# EAGLE design creekboard (EAGLE 7.2.0)
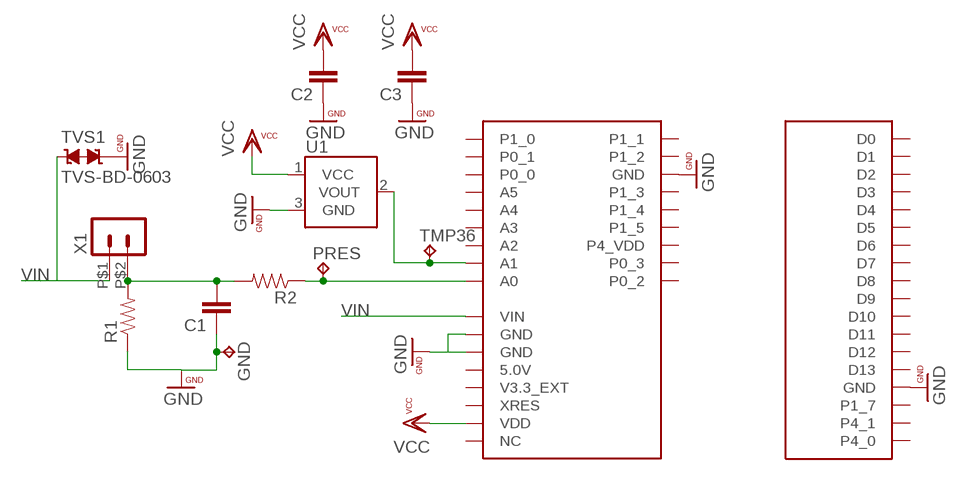
[diagram p0: schematic, sheet 1]

## Parts
C1  CAP0603-CAP  [0603-CAP]
C2  CAP0603-CAP  [0603-CAP]
C3  CAP0603-CAP  [0603-CAP]
GND  TP-040  [TP-040]
PRES  TP-040  [TP-040]
R1  RESISTOR0805-RES  [0805]
R2  RESISTOR0603-RES  [0603-RES]
TMP36  TP-040  [TP-040]
TVS1  TVS-BD-0603  [TVS0603]
U1  TMP36GT9  [TO-92]
U2  PIONEERNO_SILK  [PIONEER]
X1  HEADER_POS2_43650-0200  [43650-0200]

## Nets
GND [power]: C1.1 C2.1 C3.1 GND.1 R1.1 TVS1.2 U1.3(GND) U2.GND@2(GND) U2.GND@3(GND) U2.GND@3R(GND) U2.GND@7(GND)
N$1: C1.2 R1.2 R2.2 X1.P$2
N$2: PRES.1 R2.1 U2.A0
N$3: TMP36.1 U1.2(VOUT) U2.A1
VCC [power]: C2.2 C3.2 U1.1(VCC) U2.P4_VDD1(VDD)
VIN [power]: TVS1.1 U2.VIN X1.P$1
Unconnected: U2.3.3V(V3.3_EXT) U2.5V(5.0V) U2.A2 U2.A3 U2.A4 U2.A5 U2.AREF(P1_7) U2.D0 U2.D1 U2.D2 U2.D3 U2.D4 U2.D5 U2.D6 U2.D7 U2.D8 U2.D9 U2.D10 U2.D11 U2.D12 U2.D13 U2.NC@8(NC) U2.P0_0 U2.P0_1 U2.P0_2 U2.P0_3 U2.P1_0 U2.P1_1 U2.P1_2 U2.P1_3 U2.P1_4 U2.P1_5 U2.P4_VDD U2.SCL(P4_0) U2.SDA(P4_1) U2.XRES

## Library data of the parts
C1-C3 = SparkFun-Capacitors:CAP: Capacitor Standard 0603 ceramic capacitor, and 0.1" leaded capacitor.
GND PRES TMP36 = keystone:TP: TEST POINT PCB Vertical Mount
R1 = SparkFun-Passives:RESISTOR: Resistor
R2 = SparkFun:RESISTOR: Resistor
TVS1 = supressor:TVS-BD-: TVS BI-DIRECTIONAL
U1 = SparkFun-Sensors:TMP36: Precision degC temp sensor, analog out
U2 = arh:PIONEER: Arduino shield footprint
X1 = con-molex-micro-fit-3_0:HEADER_POS2_?: Molex - Micro-Fit 3.0 Series connector, 3.00mm (0.118") pitch header, 2 positions.

## Net classes
1 power: width 0.762 mm, clearance 0.254 mm

## Board
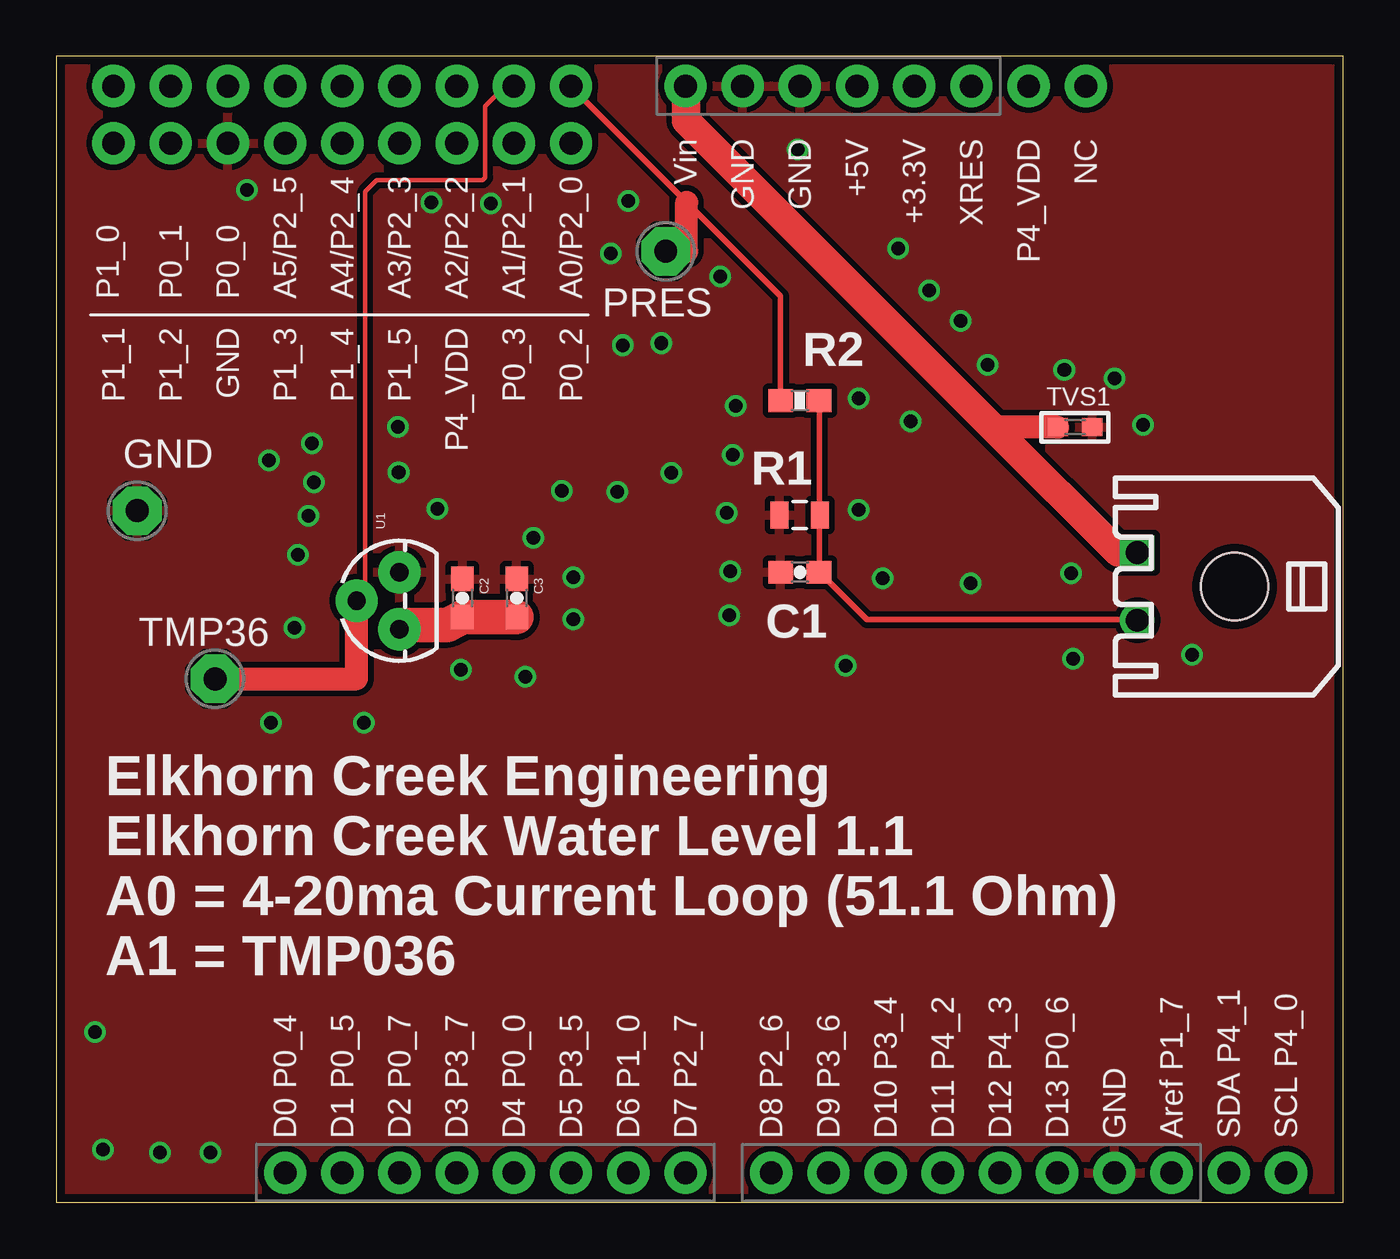
[diagram p1: board, top side]
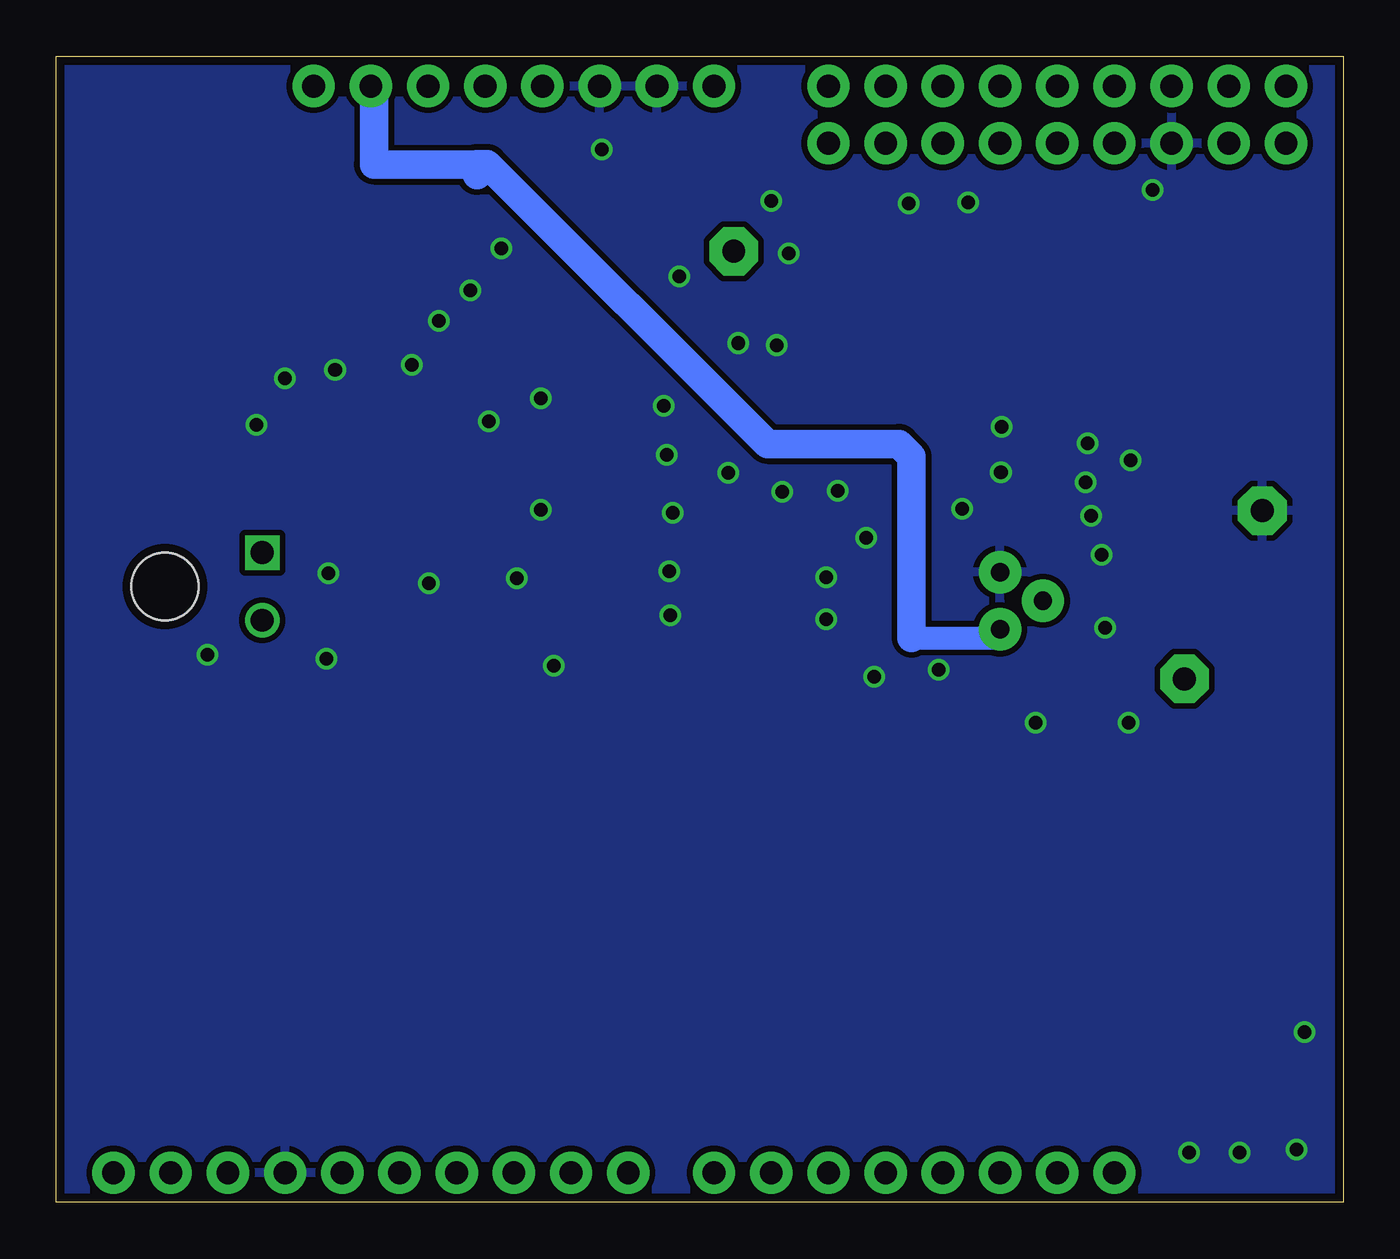
[diagram p2: board, bottom side, seen from below]

Size 57.15 x 50.9 mm. Coordinates in mm from the lower left corner, seen from the top.
Outline: 0,0 57.15,0 57.15,50.9 0,50.9 0,0
Copper layers (1*16): Top 0.0356mm / dielectric 1.5011mm / Bottom 0.0356mm
Design rules "LaenPCBOrder *": minimum track width 6mil, minimum drill 13mil, track to track 6mil, track to pad 6mil, pad to pad 6mil, via to via 6mil, smd to smd 6mil, copper to edge 15mil, drill to drill 6mil, minimum pad ring 7mil, minimum via ring 7mil, stop-mask expansion 3mil, vias tented up to drill 25mil, thermal gap 10mil

### Footprints (pad centres in the part's own frame; a part is rotated, then mirrored left to right if it is on the bottom)
0603-CAP = smd 1.1 x 1: 1 -0.85,0; 2 0.85,0
TP-040 = drill 1.016 pad 2.159 octagon: 1 0,0
0805 = smd 0.8 x 1.2: 1 -0.9,0; 2 0.9,0
0603-RES = smd 1.1 x 1: 1 -0.85,0; 2 0.85,0
TVS0603 = smd 0.9 x 0.8: 1 -0.762,0; 2 0.762,0
TO-92 = drill 0.813 pad 1.88: 1 -1.27,0; 2 0,1.905; 3 1.27,0
PIONEER = drill 1.016 pad 1.88: 3.3V 50.8,13.97; 5V 50.8,16.51; A0 50.8,29.21; A1 50.8,31.75; A2 50.8,34.29; A3 50.8,36.83; A4 50.8,39.37; A5 50.8,41.91; AREF 2.54,2.54; D0 2.54,41.91; D1 2.54,39.37; D2 2.54,36.83; D3 2.54,34.29; D4 2.54,31.75; D5 2.54,29.21; D6 2.54,26.67; D7 2.54,24.13; D8 2.54,20.32; D9 2.54,17.78; D10 2.54,15.24; D11 2.54,12.7; D12 2.54,10.16; D13 2.54,7.62; GND@2 50.8,21.59; GND@3 50.8,19.05; GND@3R 48.26,44.45; GND@7 2.54,5.08; NC@8 50.8,6.35; P0_0 50.8,44.45; P0_1 50.8,46.99; P0_2 48.26,29.21; P0_3 48.26,31.75; P1_0 50.8,49.53; P1_1 48.26,49.53; P1_2 48.26,46.99; P1_3 48.26,41.91; P1_4 48.26,39.37; P1_5 48.26,36.83; P4_VDD 48.26,34.29; P4_VDD1 50.8,8.89; SCL 2.54,-2.54; SDA 2.54,0; VIN 50.8,24.13; XRES 50.8,11.43
43650-0200 = drill 1.02 square: P$1 1.5,4.32 | drill 1.02: P$2 -1.5,4.32 | hole 3: 0,0

### Placement (x,y rotation side)
C1  33.02,27.99 0 top
C2  18.03,26.85 270 top
C3  20.45,26.85 270 top
GND  3.59,30.72 0 top
PRES  27.06,42.24 0 top
R1  33.02,30.53 0 top
R2  33.02,35.61 0 top
TMP36  7.05,23.25 0 top
TVS1  45.24,34.43 0 top
U1  15.24,26.72 90 top
U2  52.07,-1.22 90 top
X1  52.32,27.36 90 top

### Tracks (layer width: path | path; a pad name or v marks a point on that pad's centre or on a via)
GND  (via drill 0.6)
  other vias: 9.44,32.97 11.34,33.72 11.43,31.99 11.2,30.49 10.72,28.77 15.16,34.46 15.2,32.44 16.92,30.81 27.3,32.4 29.49,41.14 24.63,42.15 25.4,44.49 45.06,27.94 40.61,27.5 36.69,27.71 35.64,30.76 35.64,35.71 30.18,35.37 30.05,33.2 29.78,30.63 29.92,28.03 29.88,26.09 35.05,23.84 2.08,2.35 4.6,2.22 6.85,2.22 1.73,7.57 45.15,24.14 50.44,24.32 48.26,34.53 40.16,39.15 41.35,37.2 38.76,40.51 37.39,42.37 32.93,46.77 8.46,44.96 19.3,44.37 16.65,44.41 21.18,29.53 22.95,27.76 22.95,25.91 20.83,23.34 17.96,23.66 25.16,38.07 26.86,38.16 22.44,31.61 24.92,31.56 10.57,25.51 9.53,21.3 13.65,21.3 37.93,34.68 44.77,36.98 46.99,36.59
  pour Top: 0,50.85 0,0.05 57.15,0.05 57.15,50.85
  pour Bottom: -0.51,50.85 -0.51,0.05 57.15,0.05 57.15,50.85
N$1
  Top 0.254: R2.2 33.88,35.56 33.88,30.64 R1.2 33.88,30.53 33.88,28.02 C1.2 33.95,27.94 36.01,25.88 47.89,25.88 X1.P$2
N$2
  Top 0.254: R2.1 32.17,35.67 32.17,40.25 28,44.42 22.91,49.5 U2.A0
  Top 1.016: PRES.1 28,42.24 28,44.42
N$3
  Top 0.203: U1.2 13.72,27.1 13.72,44.88 14.22,45.39 18.92,45.39 19.05,45.52 19.05,48.69 19.94,49.58 U2.A1
  Top 1.016: TMP36.1 13.34,23.25 U1.2
VCC
  Top 1.524: C3.2 20.34,26 18.06,26 C2.2 17.37,25.65 15.43,25.65 15.32,25.54 U1.1
  Bottom 1.016: 19.16,25.07 15.24,25.07 U1.1
  Bottom 1.27: 19.16,25.07 19.16,33.12 19.72,33.68 25.58,33.68 38.01,46.11 38.47,46.11 38.47,46.09 | U2.P4_VDD1 43.04,49.58 43.04,46.09 38.47,46.09 | 38.47,46.09 38.47,45.63
VIN
  Top 1.016: TVS1.1 41.77,34.43 41.77,34.24
  Top 1.27: U2.VIN 27.96,49.56 27.96,48.04 41.77,34.24 47.15,28.86 X1.P$1

### Text on the board
tNames: Elkhorn Creek Engineering / Elkhorn Creek Water Level 1.1 / A0 = 4-20ma Current Loop (51.1 Ohm) / A1 = TMP036